# Altium schematic sheet BOOST LM5112.SchDoc
size A4
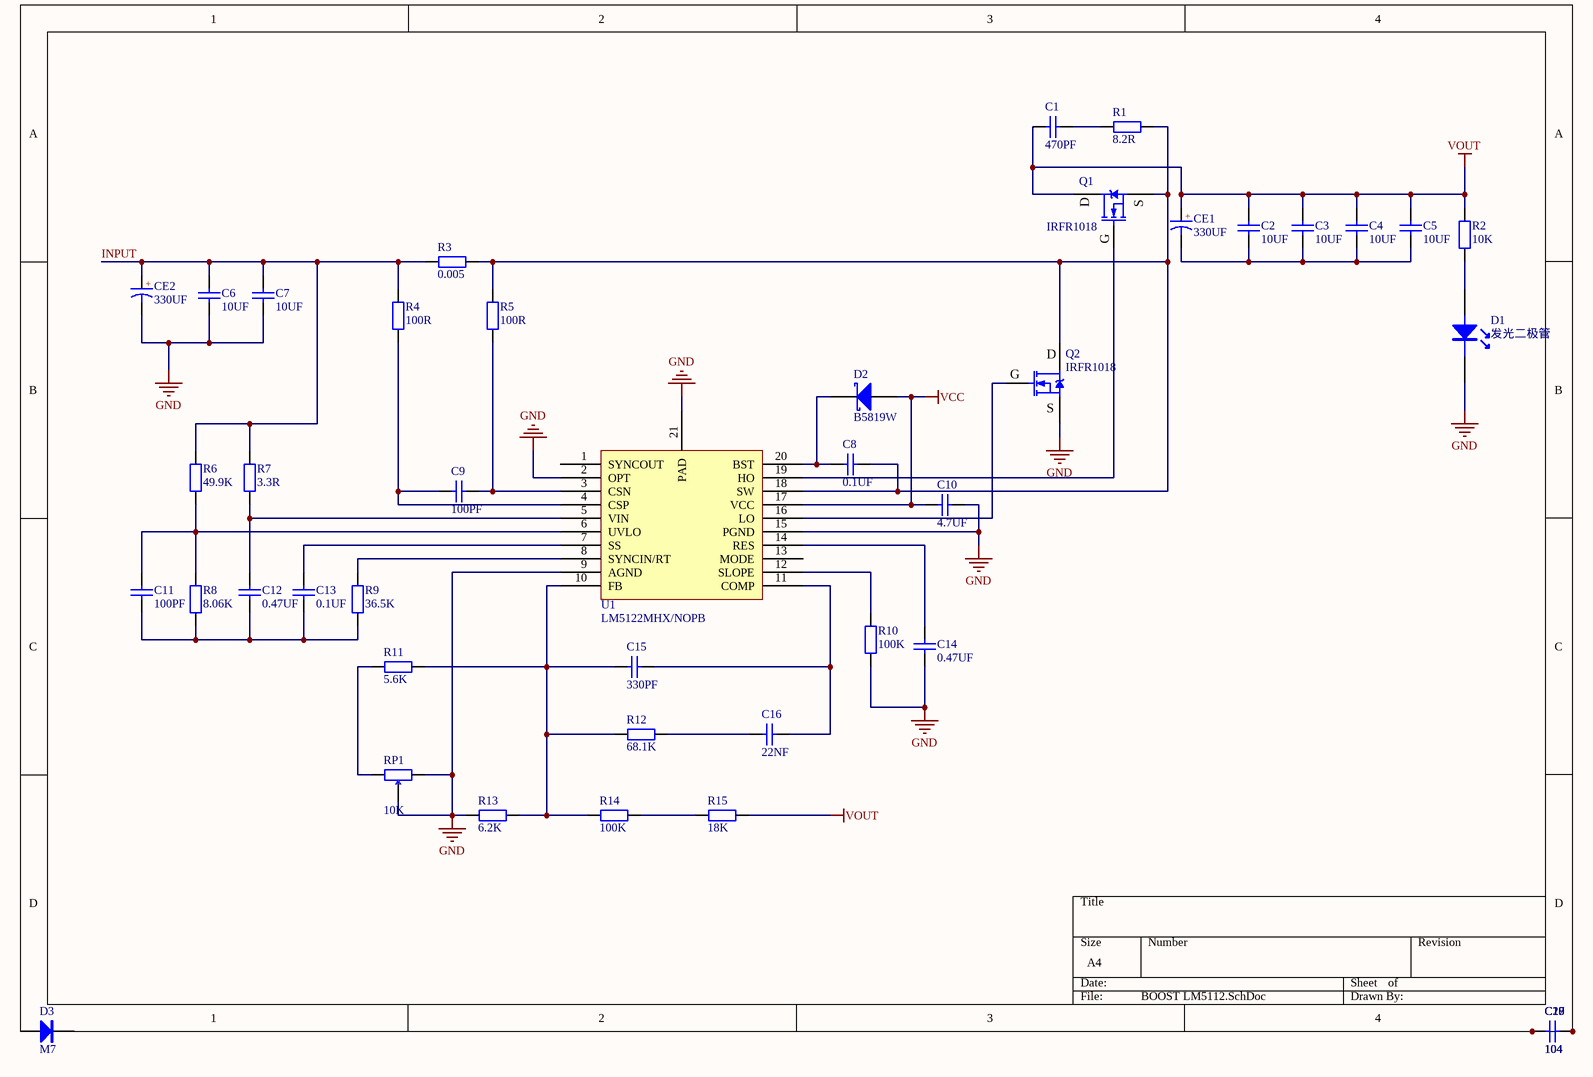
[diagram p0: BOOST LM5112.SchDoc]

## Parts
C1  470PF  [C-10uF]
C2  10UF  [C-10uF]
C3  10UF  [C-10uF]
C4  10UF  [C-10uF]
C5  10UF  [C-10uF]
C6  10UF  [C-10uF]
C7  10UF  [C-10uF]
C8  0.1UF
C9  100PF  [C-10uF]
C10  4.7UF  [C-10uF]
C11  100PF  [C-10uF]
C12  0.47UF  [C-10uF]
C13  0.1UF  [C-10uF]
C14  0.47UF  [C-10uF]
C15  330PF  [C-10uF]
C16  22NF  [C-10uF]
C17  104  [C-10uF]
C18  104  [C-10uF]
C19  104  [C-10uF]
C20  104  [C-10uF]
CE1  330UF  [C-10uF]
CE2  330UF  [C-10uF]
D1  发光二极管  [LED 5MM-W]
D2  B5819W  [AXIAL-0.4]
D3  M7  [SMA]
Q1  IRFR1018  [TO220A]
Q2  IRFR1018  [TO220A]
R1  8.2R  [AXIAL-0.4]
R2  10K  [AXIAL-0.4]
R3  0.005  [采样电阻0.005R]
R4  100R  [AXIAL-0.4]
R5  100R  [AXIAL-0.4]
R6  49.9K  [AXIAL-0.4]
R7  3.3R  [AXIAL-0.4]
R8  8.06K  [AXIAL-0.4]
R9  36.5K  [AXIAL-0.4]
R10  100K  [AXIAL-0.4]
R11  5.6K  [AXIAL-0.4]
R12  68.1K  [AXIAL-0.4]
R13  6.2K  [AXIAL-0.4]
R14  100K  [AXIAL-0.4]
R15  18K  [AXIAL-0.4]
RP1  10K  [3296W]
U1  LM5122MHX/NOPB  [HTSSOP-20_L6.5-W4.4-P0.65-LS6.4-BL-EP]

## Nets
GND: C6.1 C7.1 C10.1 C14.1 CE2.2 D1.K Q2.3(S) R10.1 R13.1 RP1.1 RP1.2 U1.2(OPT) U1.9(AGND) U1.15(PGND) U1.21(PAD)
VCC: C10.2 D2.1(A) U1.17(VCC)
VOUT: C1.1 C2.2 C3.2 C4.2 C5.2 CE1.1 Q1.2(D) R2.2 R15.2
INPUT: C6.2 C7.2 CE2.1 R3.1 R4.2 R6.2 R7.2
NetC1_2: C1.2 R1.1
NetC2_1: C2.1 C3.1 C4.1 C5.1 CE1.2
NetC8_1: C8.1 Q1.3(S) Q2.2(D) R1.2 R3.2 R5.2 U1.18(SW)
NetC8_2: C8.2 D2.2(K) U1.20(BST)
NetC9_1: C9.1 R4.1 U1.4(CSP)
NetC9_2: C9.2 R5.1 U1.3(CSN)
NetC11_1: C11.1 C12.1 C13.1 R8.1 R9.1
NetC11_2: C11.2 R6.1 R8.2 U1.6(UVLO)
NetC12_2: C12.2 R7.1 U1.5(VIN)
NetC13_2: C13.2 U1.7(SS)
NetC14_2: C14.2 U1.14(RES)
NetC15_1: C15.1 R11.2 R12.1 R13.2 R14.1 U1.10(FB)
NetC15_2: C15.2 C16.2 U1.11(COMP)
NetC16_1: C16.1 R12.2
NetC17_1: C17.1 C18.1 C19.1 C20.1
NetC17_2: C17.2 C18.2 C19.2 C20.2
NetD1_A: D1.A R2.1
NetQ1_1: Q1.1(G) U1.19(HO)
NetQ2_1: Q2.1(G) U1.16(LO)
NetR9_2: R9.2 U1.8(SYNCIN/RT)
NetR10_2: R10.2 U1.12(SLOPE)
NetR11_1: R11.1 RP1.3
NetR14_2: R14.2 R15.1

Not connected (* = marked no-connect by the designer): D3 1(A) 2(K); U1 1(SYNCOUT) 13(MODE)

## Notes on the sheet
- (in symbol CE) +

## Library data of the parts
C1-C20 = CC: 瓷片电容; BOM名称: 直插瓷片电容; 联系卖家，免费查找封装: 唯一出售店铺网址https://shop463601444.taobao.com; 封装库来自淘宝卖家ID：黄晶宝石: 其他店铺购入均为盗版假冒封装库，请立即申请退款
CE1 CE2 = CE: 直插电解电容; 联系卖家，免费查找封装: 唯一出售店铺网址https://shop463601444.taobao.com; 封装库来自淘宝卖家ID：黄晶宝石: 其他店铺购入均为盗版假冒封装库，请立即申请退款; BOM名称: 直插电解电容
D1 = 发光二极管: LED; 联系卖家，免费查找封装: 唯一出售店铺网址https://shop463601444.taobao.com
D2 = SS14: 肖特基二极管; 属性: 40V/1A; 联系卖家，免费查找封装: 唯一出售店铺网址https://shop463601444.taobao.com; BOM名称: 肖特基二极管
D3 = M7: 整流二极管; 联系卖家，免费查找封装: 唯一出售店铺网址https://shop463601444.taobao.com; BOM名称: 整流二极管
Q1 Q2 = IRF3710: N沟道 100V/57A; BOM名称: N沟场效应管; 联系卖家，免费查找封装: 唯一出售店铺网址https://shop463601444.taobao.com; 封装库来自淘宝卖家 ID：黄晶宝石: 其他店铺购入均为盗版，不享受售后技术支持服务，请立即申请退款
R1-R15 = R-S: 色环电阻; 联系卖家，免费查找封装: 唯一出售店铺网址https://shop463601444.taobao.com; 封装库来自淘宝卖家ID：黄晶宝石: 其他店铺购入均为盗版假冒封装库，请立即申请退款; BOM名称: 色环电阻
RP1 = RP: 单联电位器; BOM名称: 插件电位器; 联系卖家，免费查找封装: 唯一出售店铺网址https://shop463601444.taobao.com; 封装库来自淘宝卖家ID：黄晶宝石: 其他店铺购入均为盗版假冒封装库，请立即申请退款
U1 = Component_1